# Altium schematic sheet TC_Interface.SchDoc
size A4
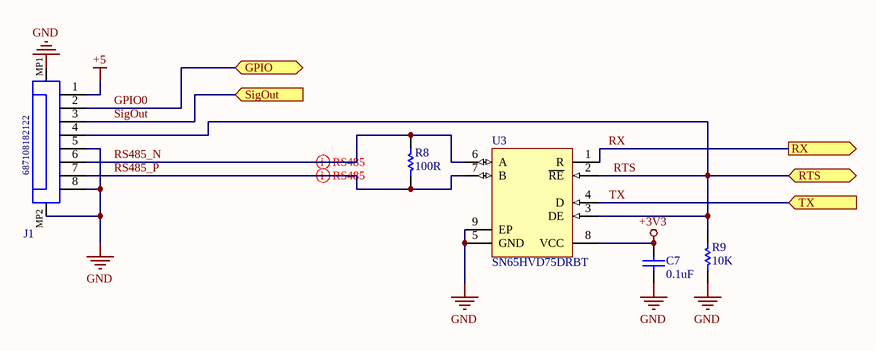
[diagram p0: TC_Interface.SchDoc]

## Parts
C7  0.1uF  [CAPC1608X95X40NL15T15]
J1  687108182122  [687108182122]
R8  100R  [RESC0603(1608)_N]
R9  10K  [RESC0603(1608)_N]
U3  SN65HVD75DRBT  [DRB0008B_V]

## Ports
GPIO (bidir), RTS (bidir), RX (out), SigOut (in), TX (in)

## Nets
+3V3: C7.2 U3.8(VCC)
+5: J1.1
GND: C7.1 J1.5 J1.8 J1.MP1 J1.MP2 R9.2 U3.5(GND) U3.9(EP)
GPIO0: J1.2 ; port GPIO
RS485_N: J1.6 R8.1 U3.6(A)
RS485_P: J1.7 R8.2 U3.7(B)
RTS: J1.4 R9.1 U3.2(~{RE}) U3.3(DE) ; port RTS
RX: U3.1(R) ; port RX
SigOut: J1.3 ; port SigOut
TX: U3.4(D) ; port TX

## Layout directives
differential pair; differential pair class *: RS485_N, RS485_P

## Library data of the parts
C7 = CMP-2006-01884-1: Part Number: VJ0603Y104JXQCW1BC; Manufacturer: Vitramon
J1 = CMP-1502-01646-1: SMT ZIF Connectors WR-FPC, Horizontal, Back Locking Dual Contact, pitch 0.5 mm, 8 pins; Manufacturer: Wurth Elektronik; Contact Resistance: 30mOhm; Working Voltage: 50VAC; Withstanding Voltage: 250VAC; Pin Number: 8; Rated Current: 0.5A; Pitch: 0.5mm; Manufacturer URL: http://www.we-online.de; Mounting Technology: SMT; Contact Design: BackLockingDualContact; Part Number: 687108182122; Package Reference: 687108182122; Orientation: Horizontal; Operating Temperature: -55to85degC; Datasheet URL: https://katalog.we-online.de/em/datasheet/687108182122.pdf; Publisher: WurthElektronik; Packaging: TapeandReel
R8 R9 = CMP-1012-00623-1: 10K 0.1W 1% 0603 (1608 Metric)  SMD; Value: 10000.00 Ohm; Case-EIA: 0603; Case-Metric: 1608; Power: 0.1 W; Tolerance: 1 %; Technology: SMT
U3 = CMP-0694-00015-2: 3.3 V Supply RS-485 with IEC ESD Protection, 20 Mbps, -40 to 125 degC, 8-Pin SON, RoHS, Tape and Reel; Manufacturer: Texas Instruments; VI: -7 to 12 V; ESD: 15 kV; VCC: 3 to 3.6 V; ICC (Max) (mA): 0.95; Signaling Rate (Max) (Mbps): 20; No. of TX: 1; Packing: Tape and Reel; ComponentLink3Description: Package Specification; RoHS: TRUE; PartNumber: SN65HVD75DRBT; ComponentLink2URL: http://www.ti.com/lit/ds/sllse11c/sllse11c.pdf; ComponentLink2Description: Datasheet; ComponentLink3URL: http://www.ti.com/lit/ds/sllse11c/sllse11c.pdf; PackageVersion: 4203482-2/K; DatasheetVersion: SLLSE11C; PackageReference: DRB0008B; PackageDescription: 8-Pin Plastic Small Outline No-Lead, Body 3 x 3 mm, Pitch 0.65 mm; ComponentLink1Description: Manufacturer URL; Operating Temperature Range: -40 to 125 degC; No. of RX: 1; Mounting Technology: Surface Mount; ComponentLink1URL: http://www.ti.com/